# EAGLE design PTN78060W (EAGLE 7.4.0)
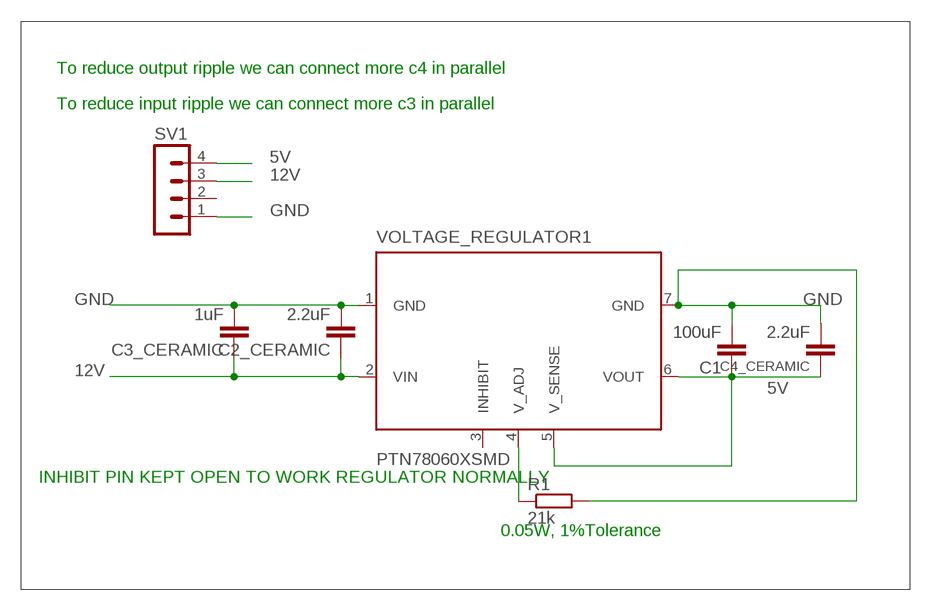
[diagram p0: schematic, sheet 1]

## Parts
C1  100uF  C-EUC0805  [C0805]
C2_CERAMIC  2.2uF  C-EUC0805  [C0805]
C3_CERAMIC  1uF  C-EUC0805  [C0805]
C4_CERAMIC  2.2uF  C-EUC0805  [C0805]
R1  21k  R-EU_R0805  [R0805]
SV1  MA04-1  [MA04-1]
VOLTAGE_REGULATOR1  PTN78060XSMD  [PTN78060X_SMD]

## Nets
5V: C1.1 C4_CERAMIC.1 SV1.4 VOLTAGE_REGULATOR1.5(V_SENSE) VOLTAGE_REGULATOR1.6(VOUT)
12V: C2_CERAMIC.1 C3_CERAMIC.1 SV1.3 VOLTAGE_REGULATOR1.2(VIN)
GND: C1.2 C2_CERAMIC.2 C3_CERAMIC.2 C4_CERAMIC.2 R1.2 SV1.1 VOLTAGE_REGULATOR1.1(GND) VOLTAGE_REGULATOR1.7(GND)
N$2: R1.1 VOLTAGE_REGULATOR1.4(V_ADJ)
Unconnected: SV1.2 VOLTAGE_REGULATOR1.3(INHIBIT)

## Notes on the sheet
- To reduce output ripple we can connect more c4 in parallel
- To reduce input ripple we can connect more c3 in parallel
- INHIBIT PIN KEPT OPEN TO WORK REGULATOR NORMALLY
- 0.05W, 1%Tolerance

## Library data of the parts
C1 C2_CERAMIC C3_CERAMIC C4_CERAMIC = resistor:C-EU: CAPACITOR, European symbol
R1 = resistor:R-EU_: RESISTOR, European symbol
SV1 = con-lstb:MA04-1: PIN HEADER; OC_FARNELL: unknown; OC_NEWARK: unknown
VOLTAGE_REGULATOR1 = PTN780XX:PTN78060X: 3 A Wide-input Adjustable Switching Regulator

## Board
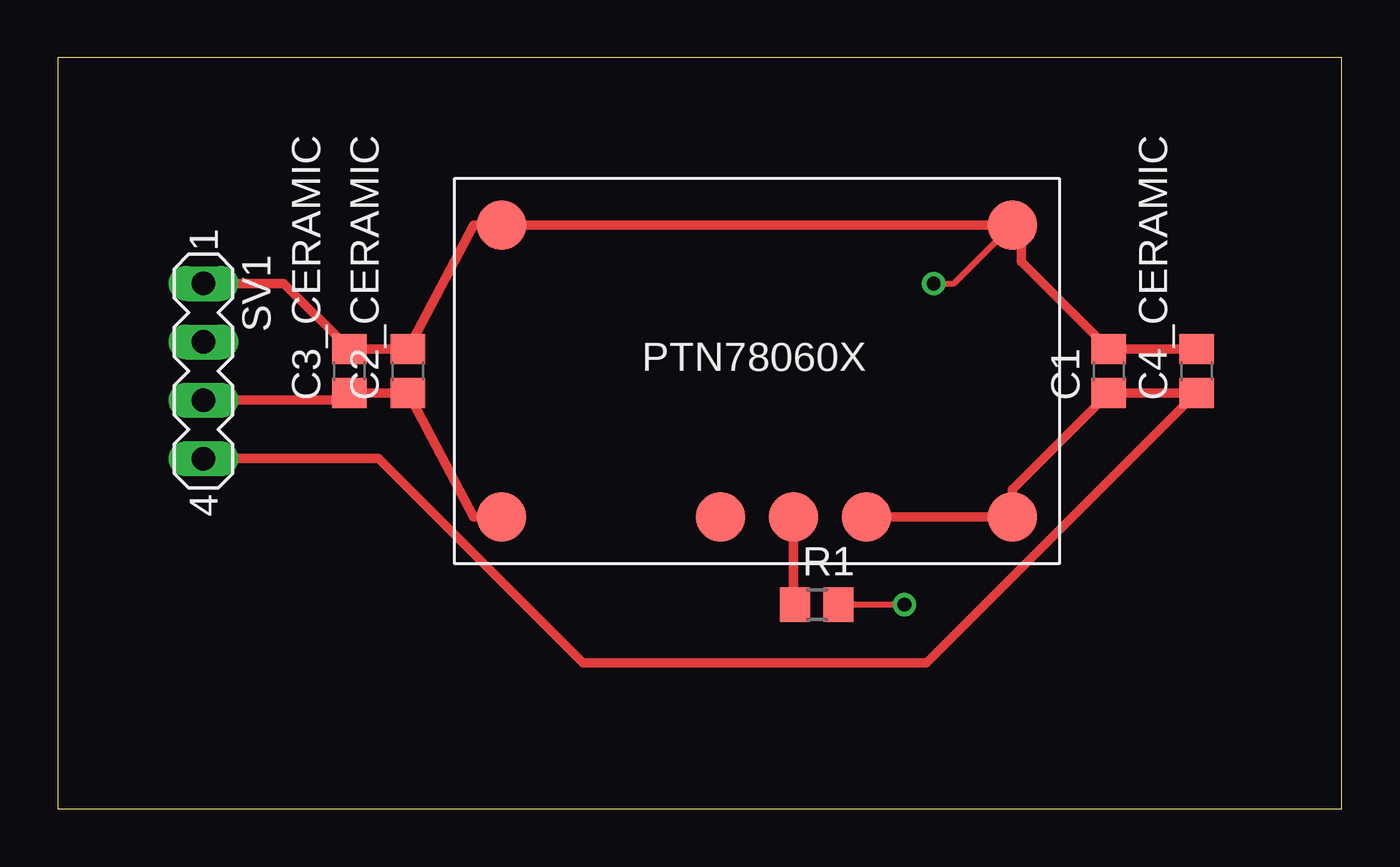
[diagram p1: board, top side]
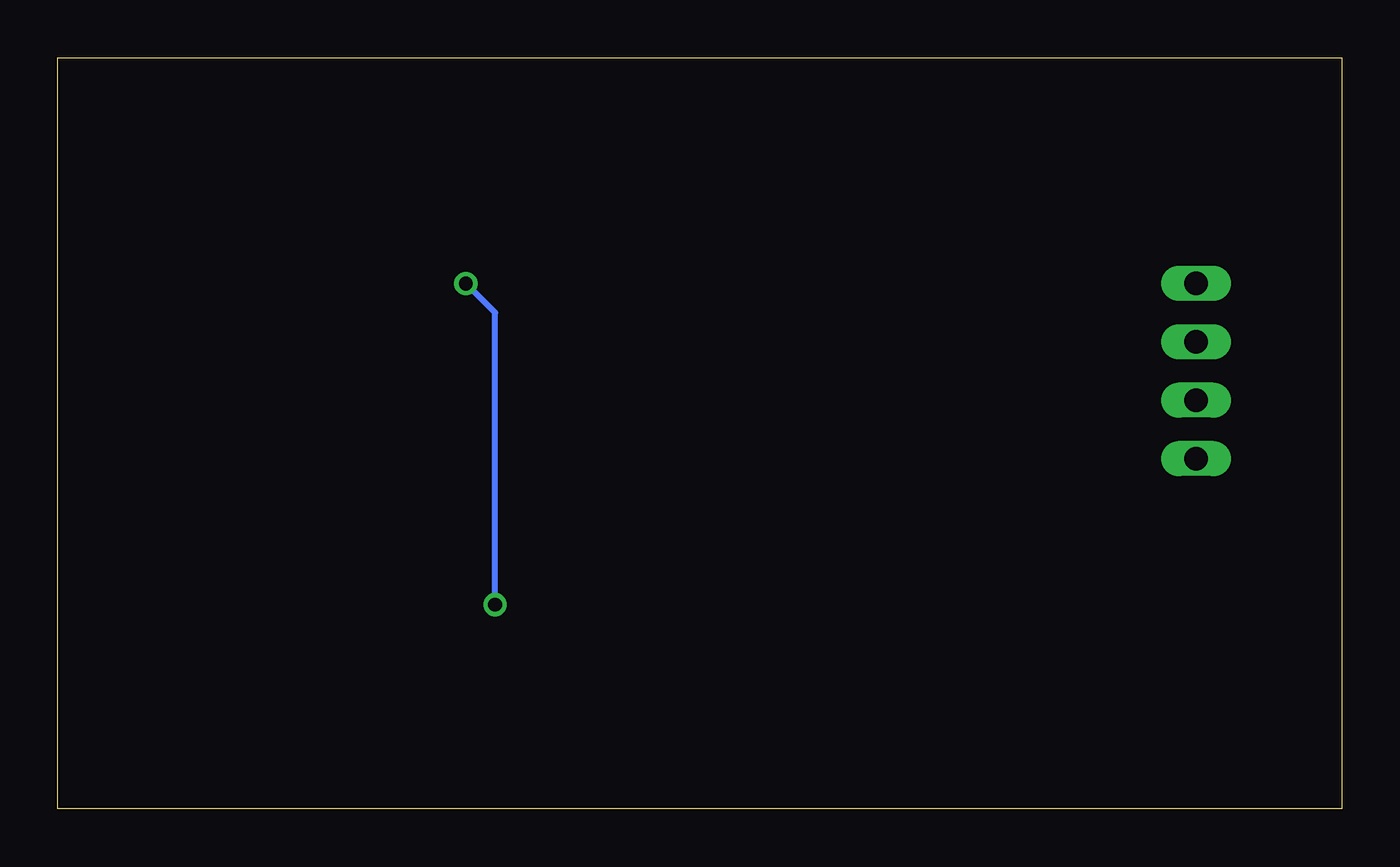
[diagram p2: board, bottom side, seen from below]

Size 55.86 x 32.69 mm. Coordinates in mm from the lower left corner, seen from the top.
Outline: 0,0 55.86,0 55.86,32.69 0,32.69 0,0
Copper layers (1*16): Top 0.035mm / dielectric 1.5mm / Bottom 0.035mm
Design rules "default": minimum track width 10mil, minimum drill 24mil, track to track 8mil, track to pad 8mil, pad to pad 8mil, via to via 8mil, smd to smd 8mil, copper to edge 40mil, drill to drill 8mil, minimum pad ring 10mil, minimum via ring 8mil, stop-mask expansion 4mil, vias tented up to drill 0mil, thermal gap 10mil

### Footprints (pad centres in the part's own frame; a part is rotated, then mirrored left to right if it is on the bottom)
C0805 = smd 1.3 x 1.5: 1 -0.95,0; 2 0.95,0
R0805 = smd 1.3 x 1.5: 1 -0.95,0; 2 0.95,0
MA04-1 = drill 1.016 long: 1 -3.81,0; 2 -1.27,0; 3 1.27,0; 4 3.81,0
PTN78060X_SMD = smd 2.159 x 2.159: 1 -11.176,6.35; 2 -11.176,-6.35; 3 -1.651,-6.35; 4 1.524,-6.35; 5 4.699,-6.35; 6 11.049,-6.35; 7 11.049,6.35

### Placement (x,y rotation side)
C1  45.72,19.05 90 top
C2_CERAMIC  15.24,19.05 90 top
C3_CERAMIC  12.7,19.05 90 top
C4_CERAMIC  49.53,19.05 90 top
R1  33.02,8.89 0 top
SV1  6.35,19.05 270 top
VOLTAGE_REGULATOR1  30.48,19.05 0 top

### Tracks (layer width: path | path; a pad name or v marks a point on that pad's centre or on a via)
5V
  Top 0.406: VOLTAGE_REGULATOR1.6 41.53,13.91 C1.1 C4_CERAMIC.1 37.78,6.35 22.86,6.35 13.97,15.24 SV1.4 | VOLTAGE_REGULATOR1.5 VOLTAGE_REGULATOR1.6 | VOLTAGE_REGULATOR1.6 41.91,12.7
12V
  Top 0.406: VOLTAGE_REGULATOR1.2 18.1,12.7 C2_CERAMIC.1 C3_CERAMIC.1 12.38,17.78 SV1.3
GND  (via drill 0.6, 0.6 pad 0.25)
  Top 0.254: R1.2 v36.83,8.89 | v38.1,22.86 38.99,22.86 VOLTAGE_REGULATOR1.7
  Top 0.406: C4_CERAMIC.2 C1.2 41.91,23.81 41.91,25.4 VOLTAGE_REGULATOR1.7 VOLTAGE_REGULATOR1.1 18.1,25.4 C2_CERAMIC.2 C3_CERAMIC.2 9.84,22.86 SV1.1
  Bottom 0.254: v36.83,8.89 36.83,21.59 v38.1,22.86
N$2
  Top 0.406: VOLTAGE_REGULATOR1.4 32,8.96 R1.1